# EAGLE schematic cpio_v0.1 (EAGLE 7.5.0)
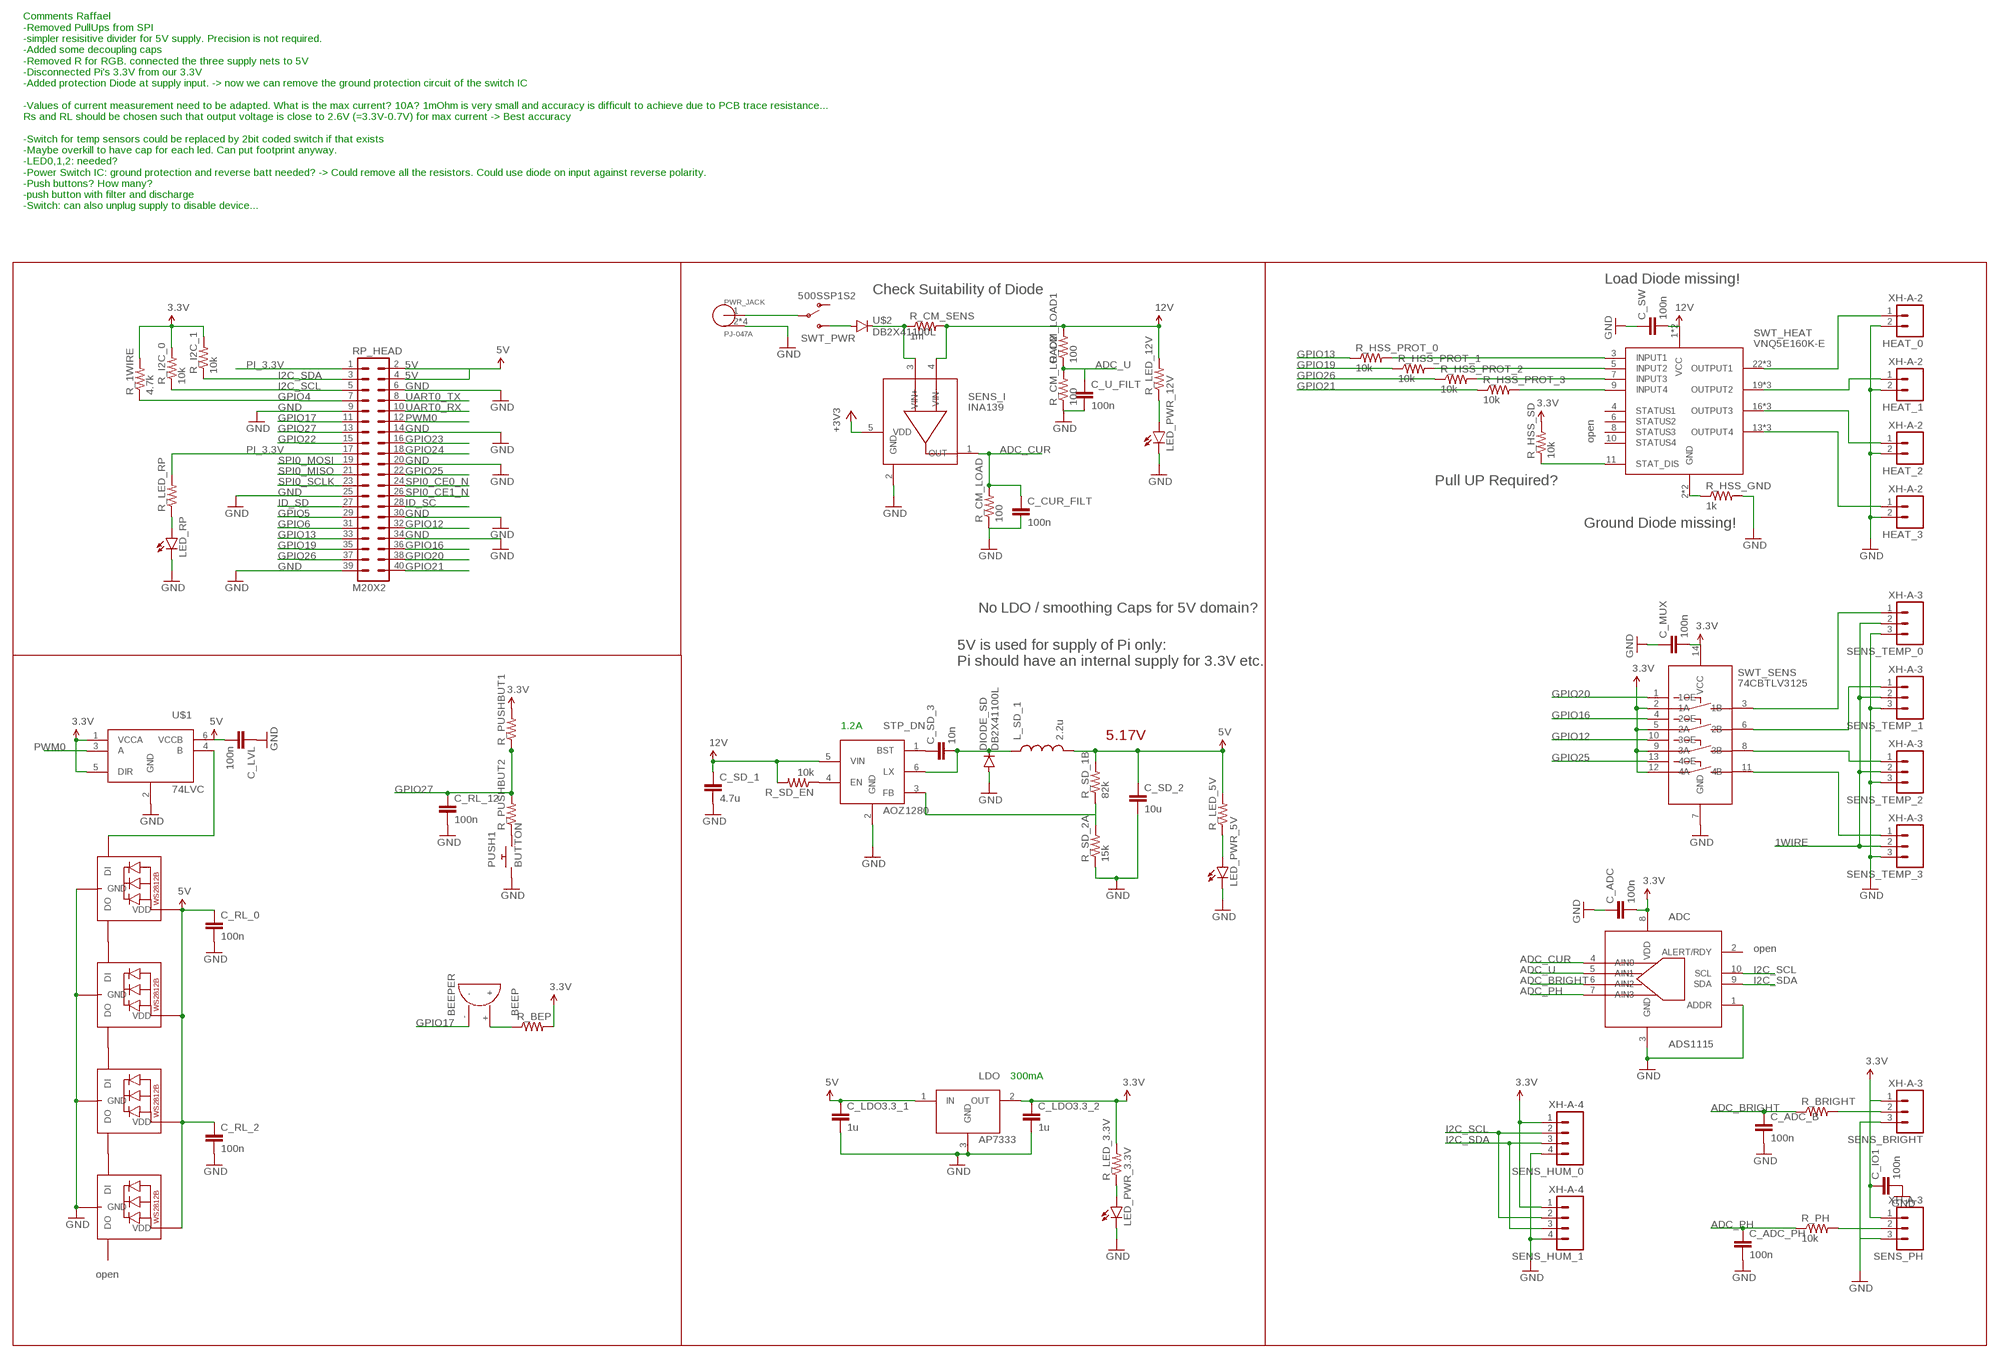
[diagram p0: schematic, sheet 1]

## Parts
ADC  ADS1115  [TFSOP-10]
BEEP  BEEPER  [BEEPER]
C_ADC  100n  CAP0805  [0805]
C_ADC_B  100n  CAP0805  [0805]
C_ADC_PH  100n  CAP0805  [0805]
C_CUR_FILT  100n  CAP0805  [0805]
C_IO1  100n  CAP0805  [0805]
C_LDO3.3_1  1u  CAP0805  [0805]
C_LDO3.3_2  1u  CAP0805  [0805]
C_LVL  100n  CAP0805  [0805]
C_MUX  100n  CAP0805  [0805]
C_RL_0  100n  CAP0805  [0805]
C_RL_2  100n  CAP0805  [0805]
C_RL_12  100n  CAP0805  [0805]
C_SD_1  4.7u  CAP0805  [0805]
C_SD_2  10u  CAP0805  [0805]
C_SD_3  10n  CAP0805  [0805]
C_SW  100n  CAP0805  [0805]
C_U_FILT  100n  CAP0805  [0805]
DIODE_SD  DB2X41100L  [SOD-123FL]
HEAT_0  XH-A-2  [XH-A-2]
HEAT_1  XH-A-2  [XH-A-2]
HEAT_2  XH-A-2  [XH-A-2]
HEAT_3  XH-A-2  [XH-A-2]
L_SD_1  2.2u  INDUCTOR0805  [0805]
LDO  AP7333  [SOT23-3]
LED_PWR_3.3V  LED1206  [LED-1206]
LED_PWR_5V  LED1206  [LED-1206]
LED_PWR_12V  LED1206  [LED-1206]
LED_RP  LED1206  [LED-1206]
PUSH1  BUTTON  [BUTTON]
PWR_JACK  PJ-047A  [PJ-047A]
R_1WIRE  4.7k  RESISTOR0805-RES  [0805]
R_BEP  RESISTOR0805-RES  [0805]
R_BRIGHT  RESISTOR0805-RES  [0805]
R_CM_LOAD  100  RESISTOR0805-RES  [0805]
R_CM_LOAD1  100  RESISTOR0805-RES  [0805]
R_CM_LOAD2  100  RESISTOR0805-RES  [0805]
R_CM_SENS  1m  RESISTOR0805-RES  [0805]
R_HSS_GND  1k  RESISTOR0805-RES  [0805]
R_HSS_PROT_0  10k  RESISTOR0805-RES  [0805]
R_HSS_PROT_1  10k  RESISTOR0805-RES  [0805]
R_HSS_PROT_2  10k  RESISTOR0805-RES  [0805]
R_HSS_PROT_3  10k  RESISTOR0805-RES  [0805]
R_HSS_SD  10k  RESISTOR0805-RES  [0805]
R_I2C_0  10k  RESISTOR0805-RES  [0805]
R_I2C_1  10k  RESISTOR0805-RES  [0805]
R_LED_3.3V  RESISTOR0805-RES  [0805]
R_LED_5V  RESISTOR0805-RES  [0805]
R_LED_12V  RESISTOR0805-RES  [0805]
R_LED_RP  RESISTOR0805-RES  [0805]
R_PH  10k  RESISTOR0805-RES  [0805]
R_PUSHBUT1  RESISTOR0805-RES  [0805]
R_PUSHBUT2  RESISTOR0805-RES  [0805]
R_SD_1B  82k  RESISTOR0805-RES  [0805]
R_SD_2A  15k  RESISTOR0805-RES  [0805]
R_SD_EN  10k  RESISTOR0805-RES  [0805]
RL_HEAT_0  WS2812B5050  [WS2812B]
RL_HEAT_1  WS2812B5050  [WS2812B]
RL_HEAT_2  WS2812B5050  [WS2812B]
RL_HEAT_3  WS2812B5050  [WS2812B]
RP_HEAD  M20X2  [2X20]
SENS_BRIGHT  XH-A-3  [XH-A-3]
SENS_HUM_0  XH-A-4  [XH-A-4]
SENS_HUM_1  XH-A-4  [XH-A-4]
SENS_I  INA139  [SOT23-5]
SENS_PH  XH-A-3  [XH-A-3]
SENS_TEMP_0  XH-A-3  [XH-A-3]
SENS_TEMP_1  XH-A-3  [XH-A-3]
SENS_TEMP_2  XH-A-3  [XH-A-3]
SENS_TEMP_3  XH-A-3  [XH-A-3]
STP_DN  AOZ1280  [SOT23-6]
SWT_HEAT  VNQ5E160K-E  [POWERSSO-24]
SWT_PWR  500SSP1S2  [SPDT-M2]
SWT_SENS  74CBTLV3125  [TSSOP-14]
U$1  74LVC  [SOT-363]
U$2  DB2X41100L  [SOD-123FL]

## Nets
1WIRE: SENS_TEMP_0.2 SENS_TEMP_1.2 SENS_TEMP_2.2 SENS_TEMP_3.2
3.3V: ADC.8(VDD) C_ADC.2 C_IO1.1 C_LDO3.3_2.1 LDO.2(OUT) R_1WIRE.2 R_BEP.2 R_HSS_SD.2 R_I2C_0.2 R_I2C_1.2 R_LED_3.3V.2 R_PUSHBUT1.2 SENS_BRIGHT.1 SENS_HUM_0.1 SENS_HUM_1.1 SENS_PH.1 SWT_SENS.2(1A) SWT_SENS.5(2A) SWT_SENS.9(3A) SWT_SENS.12(4A) SWT_SENS.14(VCC) U$1.1(VCCA) U$1.5(DIR)
3.3V1: C_MUX.2
3.3V2: C_SW.2
3.3V3: C_LVL.2
5V: C_LDO3.3_1.1 C_RL_0.1 C_RL_2.1 C_SD_2.1 L_SD_1.2 LDO.1(IN) R_LED_5V.2 R_SD_1B.2 RL_HEAT_0.1-VDD(VDD) RL_HEAT_1.1-VDD(VDD) RL_HEAT_2.1-VDD(VDD) RL_HEAT_3.1-VDD(VDD) RP_HEAD.2 RP_HEAD.4 U$1.6(VCCB)
12V: C_SD_1.1 R_CM_LOAD1.2 R_CM_SENS.2 R_LED_12V.2 R_SD_EN.2 SENS_I.4(VIN-) STP_DN.5(VIN) SWT_HEAT.1(VCC) SWT_HEAT.12(VCC)
+3V3: SENS_I.5(VDD)
ADC_BRIGHT: ADC.6(AIN2) C_ADC_B.1 R_BRIGHT.1
ADC_CUR: ADC.4(AIN0) C_CUR_FILT.1 R_CM_LOAD.2 SENS_I.1(OUT)
ADC_PH: ADC.7(AIN3) C_ADC_PH.1 R_PH.1
ADC_U: ADC.5(AIN1) C_U_FILT.1 R_CM_LOAD1.1 R_CM_LOAD2.2
GND: ADC.1(ADDR) ADC.3(GND) C_ADC.1 C_ADC_B.2 C_ADC_PH.2 C_IO1.2 C_LDO3.3_1.2 C_LDO3.3_2.2 C_LVL.1 C_MUX.1 C_RL_0.2 C_RL_2.2 C_RL_12.2 C_SD_1.2 C_SD_2.2 C_SW.1 C_U_FILT.2 DIODE_SD.A HEAT_0.2 HEAT_1.2 HEAT_2.2 HEAT_3.2 LDO.3(GND) LED_PWR_3.3V.C LED_PWR_5V.C LED_PWR_12V.C LED_RP.C PUSH1.1 PUSH1.3 PWR_JACK.2(GND) PWR_JACK.3(GND) PWR_JACK.CASE0(GND) PWR_JACK.CASE1(GND) R_CM_LOAD2.1 R_CM_LOAD.1 R_HSS_GND.2 R_SD_2A.1 RL_HEAT_0.3-GND(GND) RL_HEAT_1.3-GND(GND) RL_HEAT_2.3-GND(GND) RL_HEAT_3.3-GND(GND) RP_HEAD.6 RP_HEAD.14 RP_HEAD.20 RP_HEAD.30 RP_HEAD.34 SENS_BRIGHT.3 SENS_HUM_0.4 SENS_HUM_1.4 SENS_I.2(GND) SENS_PH.3 SENS_TEMP_0.3 SENS_TEMP_1.3 SENS_TEMP_2.3 SENS_TEMP_3.3 STP_DN.2(GND) SWT_SENS.7(GND) U$1.2(GND)
GPIO4: R_1WIRE.1
GPIO12: RP_HEAD.32 SWT_SENS.10(3OE)
GPIO13: R_HSS_PROT_0.1
GPIO16: RP_HEAD.36 SWT_SENS.4(2OE)
GPIO17: BEEP.-
GPIO19: R_HSS_PROT_1.1
GPIO20: RP_HEAD.38 SWT_SENS.1(1OE)
GPIO21: R_HSS_PROT_3.1 RP_HEAD.40
GPIO23: RP_HEAD.16
GPIO24: RP_HEAD.18
GPIO25: RP_HEAD.22 SWT_SENS.13(4OE)
GPIO26: R_HSS_PROT_2.1
GPIO27: C_RL_12.1 R_PUSHBUT1.1 R_PUSHBUT2.2
I2C_SCL: ADC.10(SCL) R_I2C_0.1 SENS_HUM_0.2 SENS_HUM_1.2
I2C_SDA: ADC.9(SDA) R_I2C_1.1 SENS_HUM_0.3 SENS_HUM_1.3
ID_SC: RP_HEAD.28
N$1: RP_HEAD.3 RP_HEAD.5 RP_HEAD.7 RP_HEAD.9 RP_HEAD.11 RP_HEAD.13 RP_HEAD.15 RP_HEAD.19 RP_HEAD.21 RP_HEAD.23 RP_HEAD.25 RP_HEAD.27 RP_HEAD.29 RP_HEAD.31 RP_HEAD.33 RP_HEAD.35 RP_HEAD.37 RP_HEAD.39
N$2: LED_PWR_12V.A R_LED_12V.1
N$3: PWR_JACK.1(PWR) SWT_PWR.2
N$4: R_HSS_GND.1 SWT_HEAT.2(GND) SWT_HEAT.PAD(GND)
N$5: PUSH1.2 PUSH1.4 R_PUSHBUT2.1
N$6: R_SD_EN.1 STP_DN.4(EN)
N$7: R_PH.2 SENS_PH.2
N$8: C_SD_3.1 STP_DN.1(BST)
N$9: R_SD_1B.1
N$10: C_SD_3.2 DIODE_SD.C L_SD_1.1 STP_DN.6(LX)
N$11: LED_PWR_5V.A R_LED_5V.1
N$12: STP_DN.3(FB)
N$13: R_SD_2A.2
N$15: LED_PWR_3.3V.A R_LED_3.3V.1
N$16: SENS_TEMP_1.1 SWT_SENS.6(2B)
N$17: SENS_TEMP_0.1 SWT_SENS.3(1B)
N$18: SENS_TEMP_2.1 SWT_SENS.8(3B)
N$19: SENS_TEMP_3.1 SWT_SENS.11(4B)
N$20: LED_RP.A R_LED_RP.1
N$23: SWT_PWR.3 U$2.A
N$24: R_CM_SENS.1 SENS_I.3(VIN+) U$2.C
N$26: HEAT_2.1 SWT_HEAT.16(OUTPUT3) SWT_HEAT.17(OUTPUT3) SWT_HEAT.18(OUTPUT3)
N$27: HEAT_1.1 SWT_HEAT.19(OUTPUT2) SWT_HEAT.20(OUTPUT2) SWT_HEAT.21(OUTPUT2)
N$28: HEAT_0.1 SWT_HEAT.22(OUTPUT1) SWT_HEAT.23(OUTPUT1) SWT_HEAT.24(OUTPUT1)
N$29: HEAT_3.1 SWT_HEAT.13(OUTPUT4) SWT_HEAT.14(OUTPUT4) SWT_HEAT.15(OUTPUT4)
N$30: R_HSS_SD.1 SWT_HEAT.11(STAT_DIS)
N$31: R_HSS_PROT_3.2 SWT_HEAT.9(INPUT4)
N$32: R_HSS_PROT_2.2 SWT_HEAT.7(INPUT3)
N$33: R_HSS_PROT_1.2 SWT_HEAT.5(INPUT2)
N$34: R_HSS_PROT_0.2 SWT_HEAT.3(INPUT1)
N$35: R_BRIGHT.2 SENS_BRIGHT.2
N$43: RL_HEAT_2.2-DOUT(DO) RL_HEAT_3.4-DIN(DI)
N$44: RL_HEAT_1.2-DOUT(DO) RL_HEAT_2.4-DIN(DI)
N$45: RL_HEAT_0.2-DOUT(DO) RL_HEAT_1.4-DIN(DI)
N$53: RL_HEAT_0.4-DIN(DI) U$1.4(B)
N$64: BEEP.+ R_BEP.1
PI_3.3V: R_LED_RP.2 RP_HEAD.1 RP_HEAD.17
PWM0: RP_HEAD.12 U$1.3(A)
SPI0_CE0_N: RP_HEAD.24
SPI0_CE1_N: RP_HEAD.26
UART0_RX: RP_HEAD.10
UART0_TX: RP_HEAD.8
Unconnected: ADC.2(ALERT/RDY) C_CUR_FILT.2 RL_HEAT_3.2-DOUT(DO) SWT_HEAT.4(STATUS1) SWT_HEAT.6(STATUS2) SWT_HEAT.8(STATUS3) SWT_HEAT.10(STATUS4) SWT_PWR.1

## Notes on the sheet
- Comments Raffael
  -Removed PullUps from SPI
  -simpler resisitive divider for 5V supply. Precision is not required.
  -Added some decoupling caps
  -Removed R for RGB. connected the three supply nets to 5V
  -Disconnected Pi's 3.3V from our 3.3V
  -Added protection Diode at supply input. -> now we can remove the ground protection circuit of the switch IC
  
  -Values of current measurement need to be adapted. What is the max current? 10A? 1mOhm is very small and accuracy is difficult to achieve due to PCB trace resistance... 
  Rs and RL should be chosen such that output voltage is close to 2.6V (=3.3V-0.7V) for max current -> Best accuracy 
  
  -Switch for temp sensors could be replaced by 2bit coded switch if that exists
  -Maybe overkill to have cap for each led. Can put footprint anyway.
  -LED0,1,2: needed?
  -Power Switch IC: ground protection and reverse batt needed? -> Could remove all the resistors. Could use diode on input against reverse polarity.
  -Push buttons? How many?
  -push button with filter and discharge
  -Switch: can also unplug supply to disable device...
- Load Diode missing!
- Check Suitability of Diode
- open
- Pull UP Required?
- Ground Diode missing!
- No LDO / smoothing Caps for 5V domain?
- 5V is used for supply of Pi only: 
  Pi should have an internal supply for 3.3V etc.
- 1.2A
- 5.17V
- open
- 300mA
- open

## Library data of the parts
ADC = cpio:ADS1115: Ultra-Small, Low-Power, 16-Bit, Analog-to-Digital Converter with Internal Reference
BEEP = cpio:BEEPER: Beeper
C_ADC C_ADC_B C_ADC_PH C_CUR_FILT C_IO1 C_LDO3.3_1 C_LDO3.3_2 C_LVL C_MUX C_RL_0 C_RL_2 C_RL_12 C_SD_1-C_SD_3 C_SW C_U_FILT = SparkFun-Passives:CAP: Capacitor Standard 0603 ceramic capacitor, and 0.1" leaded capacitor.
DIODE_SD U$2 = cpio:DB2X41100L: Diode: Silicon epitaxial planar type
HEAT_0 HEAT_1-HEAT_3 = cpio:XH-A-2: XH-A-2 Connector, 2.5mm pitch, disconnectable crimp style connector
L_SD_1 = SparkFun-Passives:INDUCTOR: Inductors Basic Inductor/Choke - 0603 and 1206. Footprints are not proven and vary greatly between part numbers. INDUCTOR POWER 3.3UH 4.0A SMD 0.197" L x 0.197" W x 0.177" H (5.00mm x 5.00mm x 4.50mm)
LDO = cpio:AP7333: 300mA, Low Quiescent Current, Fast Transient, Low Dropout Linear Regulator (LDO)
LED_PWR_3.3V LED_PWR_5V LED_PWR_12V LED_RP = SparkFun-LED:LED: LEDs Standard schematic elements and footprints for 5mm, 3mm, 1206, and 0603 sized LEDs. 5mm - Spark Fun Electronics SKU : COM-00529 (and others)
PUSH1 = cpio:BUTTON: Push Button
PWR_JACK = cpio:PJ-047A: DC Power Jack PJ-047A, 2.0 mm center pin, 2.5 A rating, right angle orientation, through hole, shielded
R_1WIRE R_BEP R_BRIGHT R_CM_LOAD R_CM_LOAD1 R_CM_LOAD2 R_CM_SENS R_HSS_GND R_HSS_PROT_0 R_HSS_PROT_1-R_HSS_PROT_3 R_HSS_SD R_I2C_0 R_I2C_1 R_LED_3.3V R_LED_5V R_LED_12V R_LED_RP R_PH R_PUSHBUT1 R_PUSHBUT2 R_SD_1B R_SD_2A R_SD_EN = SparkFun-Passives:RESISTOR: Resistor Basic schematic elements and footprints for 0603, 1206, and PTH resistors.
RL_HEAT_0 RL_HEAT_1-RL_HEAT_3 = adafruit:WS2812B
RP_HEAD = SparkFun-Connectors:M20X2: 0.1" spaced headers
SENS_BRIGHT SENS_PH SENS_TEMP_0 SENS_TEMP_1-SENS_TEMP_3 = cpio:XH-A-3: XH-A-3 Connector, 2.5mm pitch, disconnectable crimp style connector
SENS_HUM_0 SENS_HUM_1 = cpio:XH-A-4: XH-A-4 Connector, 2.5mm pitch, disconnectable crimp style connector
SENS_I = cpio:INA139: High-Side Measurement Current Shunt Monitor
STP_DN = cpio:AOZ1280: EZBuck 1.2 A Simple Buck Regulator
SWT_HEAT = cpio:VNQ5E160K-E: Quad channel high side driver for automotive applications
SWT_PWR = cpio:500SSP1S2: 3-Pole Slide Switch 28V, 5A
SWT_SENS = cpio:74CBTLV3125: 4-bit bus switch
U$1 = cpio:74LVC: Level Shifter (1.2 to 5.5V), Dual supply translating transceiver, 3-state